# Altium schematic sheet TESTER_REMOTE_STEPPER_DRIVER_01.SchDoc: TESTER_REMOTE_CONTROLLER
size A4; CheckedBy: A_MOALLEMI; DrawnBy: A_RAJABI; SheetNumber: 3; SheetTotal: 3
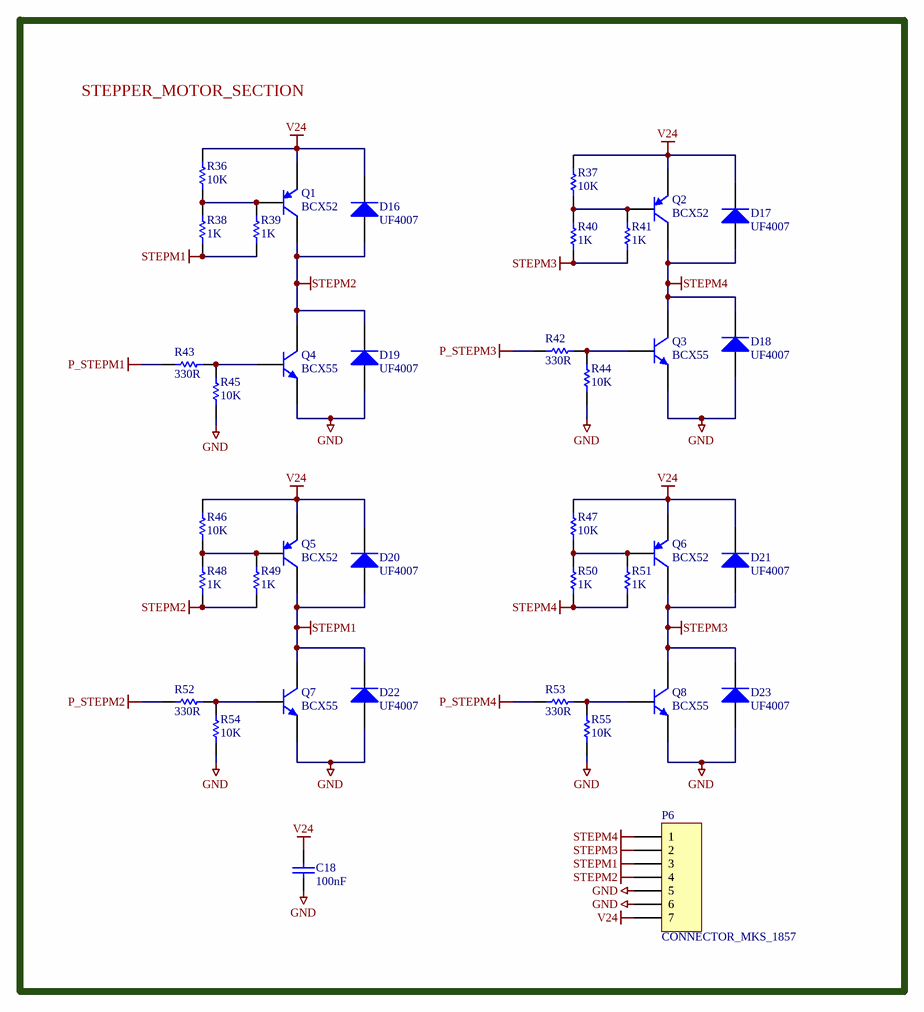
[diagram p0: TESTER_REMOTE_STEPPER_DRIVER_01.SchDoc]

## Parts
C18  100nF  [SMD 0805]
D16  UF4007  [SMD SMA]
D17  UF4007  [SMD SMA]
D18  UF4007  [SMD SMA]
D19  UF4007  [SMD SMA]
D20  UF4007  [SMD SMA]
D21  UF4007  [SMD SMA]
D22  UF4007  [SMD SMA]
D23  UF4007  [SMD SMA]
P6  CONNECTOR_MKS_1857  [CON MKS1857 7]
Q1  BCX52  [SMD SOT89 TRANSISTOR]
Q2  BCX52  [SMD SOT89 TRANSISTOR]
Q3  BCX55  [SMD SOT89 TRANSISTOR]
Q4  BCX55  [SMD SOT89 TRANSISTOR]
Q5  BCX52  [SMD SOT89 TRANSISTOR]
Q6  BCX52  [SMD SOT89 TRANSISTOR]
Q7  BCX55  [SMD SOT89 TRANSISTOR]
Q8  BCX55  [SMD SOT89 TRANSISTOR]
R36  10K  [SMD 1206]
R37  10K  [SMD 1206]
R38  1K  [SMD 1206]
R39  1K  [SMD 1206]
R40  1K  [SMD 1206]
R41  1K  [SMD 1206]
R42  330R  [SMD 1206]
R43  330R  [SMD 1206]
R44  10K  [SMD 0805]
R45  10K  [SMD 0805]
R46  10K  [SMD 1206]
R47  10K  [SMD 1206]
R48  1K  [SMD 1206]
R49  1K  [SMD 1206]
R50  1K  [SMD 1206]
R51  1K  [SMD 1206]
R52  330R  [SMD 1206]
R53  330R  [SMD 1206]
R54  10K  [SMD 0805]
R55  10K  [SMD 0805]

## Nets
GND: C18.2 D18.1 D19.1 D22.1 D23.1 P6.5 P6.6 Q3.2(E) Q4.2(E) Q7.2(E) Q8.2(E) R44.1 R45.1 R54.1 R55.1
P_STEPM1: R43.2
P_STEPM2: R52.2
P_STEPM3: R42.2
P_STEPM4: R53.2
STEPM1: D20.1 D22.2 P6.3 Q5.3(C) Q7.3(C) R38.1 R39.1
STEPM2: D16.1 D19.2 P6.4 Q1.3(C) Q4.3(C) R48.1 R49.1
STEPM3: D21.1 D23.2 P6.2 Q6.3(C) Q8.3(C) R40.1 R41.1
STEPM4: D17.1 D18.2 P6.1 Q2.3(C) Q3.3(C) R50.1 R51.1
V24: C18.1 D16.2 D17.2 D20.2 D21.2 P6.7 Q1.2(E) Q2.2(E) Q5.2(E) Q6.2(E) R36.2 R37.2 R46.2 R47.2
NetQ1_1: Q1.1(B) R36.1 R38.2 R39.2
NetQ2_1: Q2.1(B) R37.1 R40.2 R41.2
NetQ3_1: Q3.1(B) R42.1 R44.2
NetQ4_1: Q4.1(B) R43.1 R45.2
NetQ5_1: Q5.1(B) R46.1 R48.2 R49.2
NetQ6_1: Q6.1(B) R47.1 R50.2 R51.2
NetQ7_1: Q7.1(B) R52.1 R54.2
NetQ8_1: Q8.1(B) R53.1 R55.2

## Notes on the sheet
- STEPPER_MOTOR_SECTION
- DrawnBy:
- ProjectName:
- Date:
- CheckedBy:
- Size:
- A4
- File:
- Sheet
- of

## Library data of the parts
C18 = CAP: Capacitor; Published: 8-Jun-2000; LatestRevisionDate: 17-Jul-2002; LatestRevisionNote: Re-released for DXP Platform.; PackageReference: RAD-0.3; Publisher: Altium Limited; PackageDescription: Radial Cap, Thru-Hole; 2 Leads; 0.3 in Pin Spacing
D16-D23 = DIODE: Typical Diode
P6 = CONNECTOR 7: Header, 7-Pin; LatestRevisionDate: 17-Jul-2002; LatestRevisionNote: Re-released for DXP Platform.; Publisher: Altium Limited
Q1 Q2 Q5 Q6 = Q PNP: PNP Bipolar Transistor; Published: 8-Jun-2000; LatestRevisionDate: 29-May-2009; LatestRevisionNote: IPC-7351 Footprint Added.; PackageVersion: Aug-1999; PackageReference: SOT-23B; Publisher: Altium Limited; PackageDescription: 3-Pin SOT-23 Package 0.95 mm Pitch, 2.4 mm Lead Span
Q3 Q4 Q7 Q8 = Q NPN: NPN Bipolar Transistor; Published: 8-Jun-2000; LatestRevisionDate: 17-Jul-2002; LatestRevisionNote: Re-released for DXP Platform.; PackageReference: TO-226-AA; Publisher: Altium Limited; PackageDescription: TO, Flat Index; 3 In-Line, Axial Leads; Body Dia. 4.8mm; Leads 0.55 x 0.51 mm (max); Code_JEDEC: TO-226-AA
R36-R55 = RES: Resistor